# Altium schematic sheet I-O Expander.SchDoc
size A
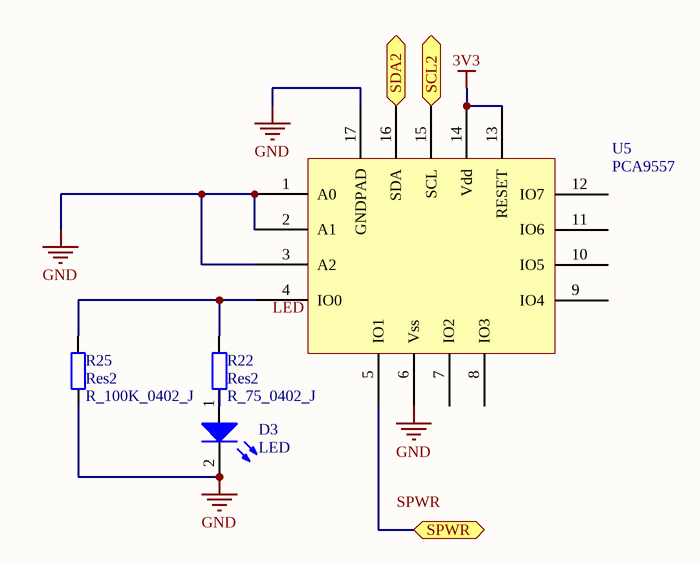
[diagram p0: I-O Expander.SchDoc]

## Parts
D3  LED  [LED]
R22  Res2  value R_75_0402_J  [R_0402]
R25  Res2  value R_100K_0402_J  [R_0402]
U5  PCA9557  [PCA9557BS]

## Ports
SCL2, SDA2, SPWR

## Nets
3V3: U5.13(RESET) U5.14(Vdd)
GND: D3.2(K) R25.1 U5.1(A0) U5.2(A1) U5.3(A2) U5.6(Vss) U5.17(GNDPAD)
SCL2: U5.15(SCL) ; port SCL2
SDA2: U5.16(SDA) ; port SDA2
SPWR: U5.5(IO1) ; port SPWR
NetD3_1: D3.1(A) R22.1
NetR22_2: R22.2 R25.2 U5.4(IO0)

Not connected (* = marked no-connect by the designer): U5 7(IO2) 8(IO3) 9(IO4) 10(IO5) 11(IO6) 12(IO7)

## Notes on the sheet
- Labels drawn without touching a wire or pin: LED, SPWR

## Library data of the parts
D3 = LED1: Typical RED GaAs LED; Published: 8-Jun-2000; LatestRevisionDate: 08-Jul-2005; LatestRevisionNote: Mech Layer 1 removed.; PackageReference: LED-1; Publisher: Altium Limited; PackageDescription: LED; 2 Leads; Supplier 1: Digi-Key; Supplier Part Number 1: 365-1204-ND; Supplier 2: Mouser; Supplier Part Number 2: 828-OVLLY8C7
R22 R25 = Res2: Resistor; Supplier 1: Digi-Key
  R22: Published: 8-Jun-2000; LatestRevisionDate: 17-Jul-2002; LatestRevisionNote: Re-released for DXP Platform.; PackageReference: AXIAL-0.4; Publisher: Altium Limited; PackageDescription: Axial Device, Thru-Hole; 2 Leads; 0.4 in Pin Spacing; Supplier Part Number 1: P75JTR-ND; Supplier 2: Mouser; Supplier Part Number 2: 667-ERJ-2GEJ750X
  R25: Supplier Part Number 1: 311-100KJRCT-ND
U5 = PCA9557: 8 channel IO expander